# EAGLE design AMS5047p (EAGLE 6.3)
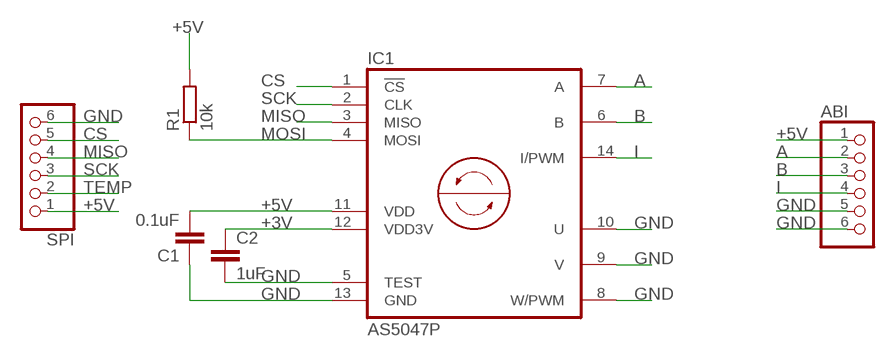
[diagram p0: schematic, sheet 1]

## Parts
ABI  PINHD-1X6  [1X06]
C1  0.1uF  C-EUC0603  [C0603]
C2  1uF  C-EUC0603  [C0603]
IC1  AS5047P  [TSSOP14]
R1  10k  R-EU_R0603  [R0603]
SPI  PINHD-1X6  [1X06]

## Nets
+3V: C2.1 IC1.12(VDD3V)
+5V: ABI.1 C1.2 IC1.11(VDD) R1.2 SPI.1
A: ABI.2 IC1.7(A)
B: ABI.3 IC1.6(B)
CS: IC1.1(!CS!) SPI.5
GND: ABI.5 ABI.6 C1.1 C2.2 IC1.5(TEST) IC1.8(W/PWM) IC1.9(V) IC1.10(U) IC1.13(GND) SPI.6
I: ABI.4 IC1.14(I/PWM)
MISO: IC1.3(MISO) SPI.4
MOSI: IC1.4(MOSI) R1.1
SCK: IC1.2(CLK) SPI.3
TEMP: SPI.2

## Library data of the parts
ABI SPI = pinhead:PINHD-1X6: PIN HEADER
C1 C2 = rcl:C-EU: CAPACITOR, European symbol
IC1 = ams:AS5047: ROTARY ENCODER 14-bit On-Axis Magnetic Rotary Position Sensor 12-Bit Decimal & Binary Incremental Pulse Count 28krpm high speed capability
R1 = rcl:R-EU_: RESISTOR, European symbol

## Net classes
0 OSC_P: width 0.305 mm, clearance 0.254 mm

## Board
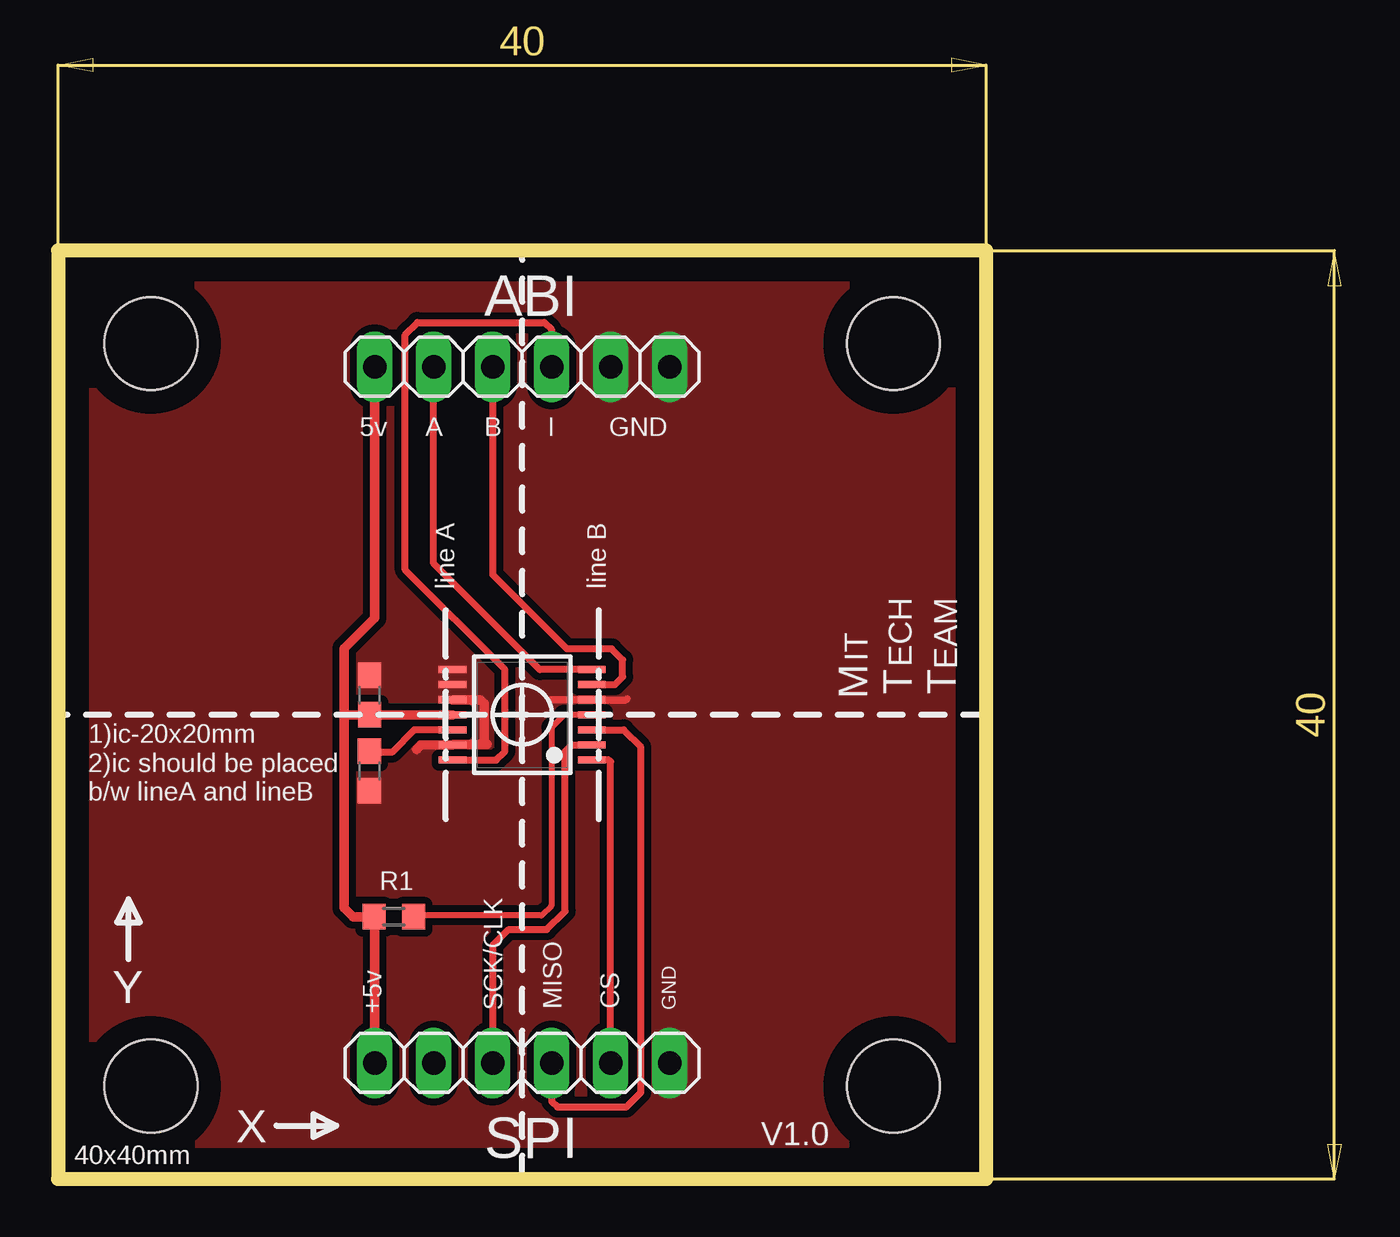
[diagram p1: board, top side]

Size 40 x 40 mm. Coordinates in mm from the lower left corner, seen from the top.
Outline: 0,0 40,0 40,40 0,40 0,0
Copper layers (1*16): Top 0.035mm / dielectric 1.5mm / Bottom 0.035mm
Design rules "default": minimum track width 10mil, minimum drill 24mil, track to track 8mil, track to pad 8mil, pad to pad 8mil, via to via 8mil, smd to smd 8mil, copper to edge 40mil, drill to drill 8mil, minimum pad ring 10mil, minimum via ring 8mil, stop-mask expansion 4mil, vias tented up to drill 0mil, thermal gap 10mil
Holes 4 mm at 4,36 36,36 4,4 36,4

### Footprints (pad centres in the part's own frame; a part is rotated, then mirrored left to right if it is on the bottom)
1X06 = drill 1.016 long: 1 -6.35,0; 2 -3.81,0; 3 -1.27,0; 4 1.27,0; 5 3.81,0; 6 6.35,0
C0603 = smd 1.1 x 1: 1 -0.85,0; 2 0.85,0
TSSOP14 = smd 0.305 x 1.2: 1 -1.95,-3; 2 -1.3,-3; 3 -0.65,-3; 4 0,-3; 5 0.65,-3; 6 1.3,-3; 7 1.95,-3; 8 1.95,3; 9 1.3,3; 10 0.65,3; 11 0,3; 12 -0.65,3; 13 -1.3,3; 14 -1.95,3
R0603 = smd 1 x 1.1: 1 -0.85,0; 2 0.85,0

### Placement (x,y rotation side)
ABI  20,35 0 top
C1  13.42,20.85 270 top
C2  13.42,17.58 270 top
IC1  20,20 90 top
R1  14.47,11.29 180 top
SPI  20,5 0 top

### Tracks (layer width: path | path; a pad name or v marks a point on that pad's centre or on a via)
+3V
  Top 0.305: IC1.12 15.35,19.35 14.39,18.39 13.46,18.39 C2.1
+5V
  Top 0.406: IC1.11 C1.2 | C1.2 | C1.2 12.32,20 12.33,19.99 | 12.33,19.99 12.33,11.68 12.71,11.29 R1.2 13.65,11.27 SPI.1 | ABI.1 13.65,24.18 12.33,22.85 12.33,19.99 | 12.33,19.99
A
  Top 0.305: IC1.7 20.76,21.95 16.19,26.52 ABI.2 | ABI.2
B
  Top 0.305: IC1.6 23.99,21.3 24.33,21.64 24.33,22.37 23.86,22.84 21.92,22.84 18.74,26.03 ABI.3
CS
  Top 0.305: SPI.5 23.81,17.97 23.73,18.05 IC1.1 | IC1.1
GND
  Top 0.305: 21.21,20.66 21.22,20.65 IC1.5 24.49,20.65 24.53,20.69
  Top 0.406: IC1.10 18.2,20.65 18.36,20.48 18.36,18.84 18.49,18.72 17.02,18.72 IC1.13 15.64,18.7 15.45,18.5
  pour Top (isolate 0.305, no thermals): 0,40 40,40 40,0 0,0
I
  Top 0.305: IC1.14 18.88,18.05 19.25,18.43 19.25,21.95 14.96,26.24 14.96,36.38 15.49,36.91 20.95,36.91 21.25,36.61 21.25,35.02 ABI.4
MISO
  Top 0.305: IC1.3 24.38,19.35 25.11,18.61 25.11,3.73 24.49,3.1 21.52,3.1 21.27,3.34 SPI.4
MOSI
  Top 0.254: IC1.4 21.8,20 21.26,19.46 21.26,11.77 20.83,11.35 15.38,11.35 R1.1
  Top 0.305: R1.1
SCK
  Top 0.305: SPI.3 18.73,10.06 19.42,10.74 21.06,10.74 21.85,11.54 21.85,18.42 22.12,18.69 IC1.2

### Text on the board
tNames: 5v | A | B | I | GND | line A | line B | ECH | EAM | IT | M / T / T | 1)ic-20x20mm | 2)ic should be placed / b/w lineA and lineB | R1 | Y | +5v | SCK/CLK | MISO | CS | GND | X | V1.0 | 40x40mm